# EAGLE board Hive 2.0 (EAGLE 9.6.2), part 1 of 2
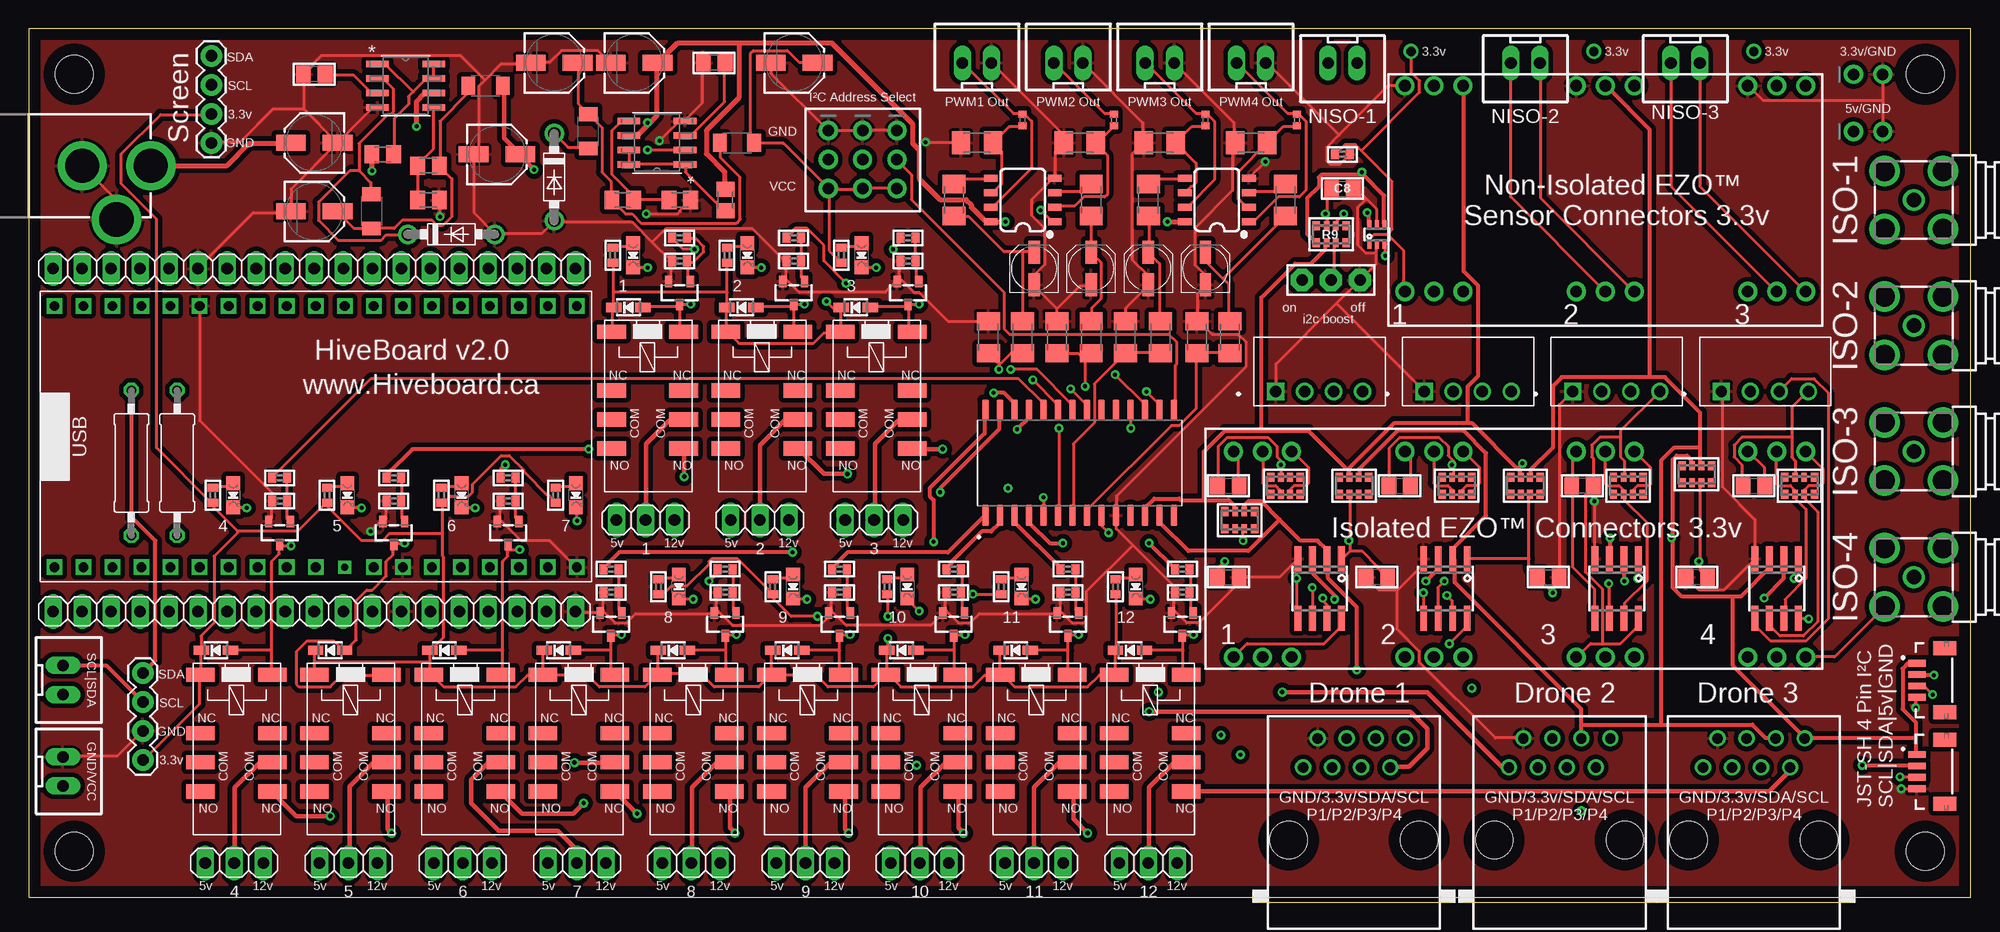
[diagram p7: board, top side]
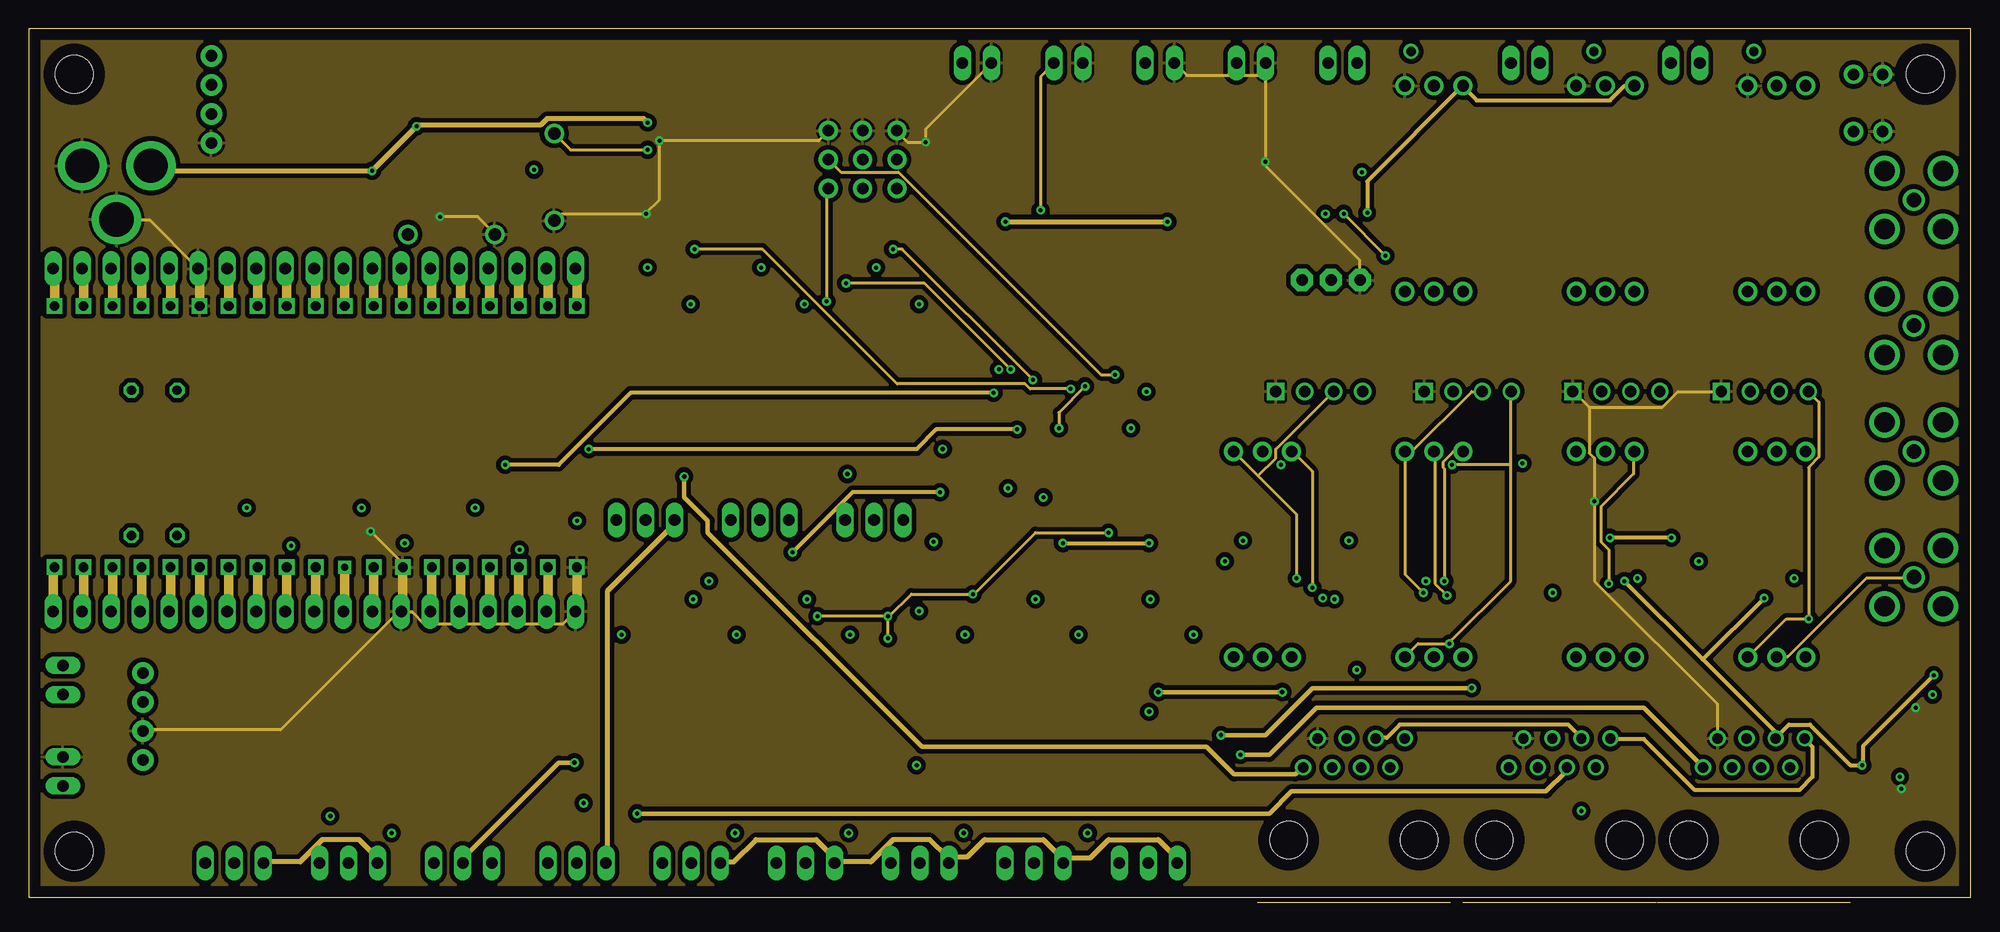
[diagram p8: board, inner layer Route2]
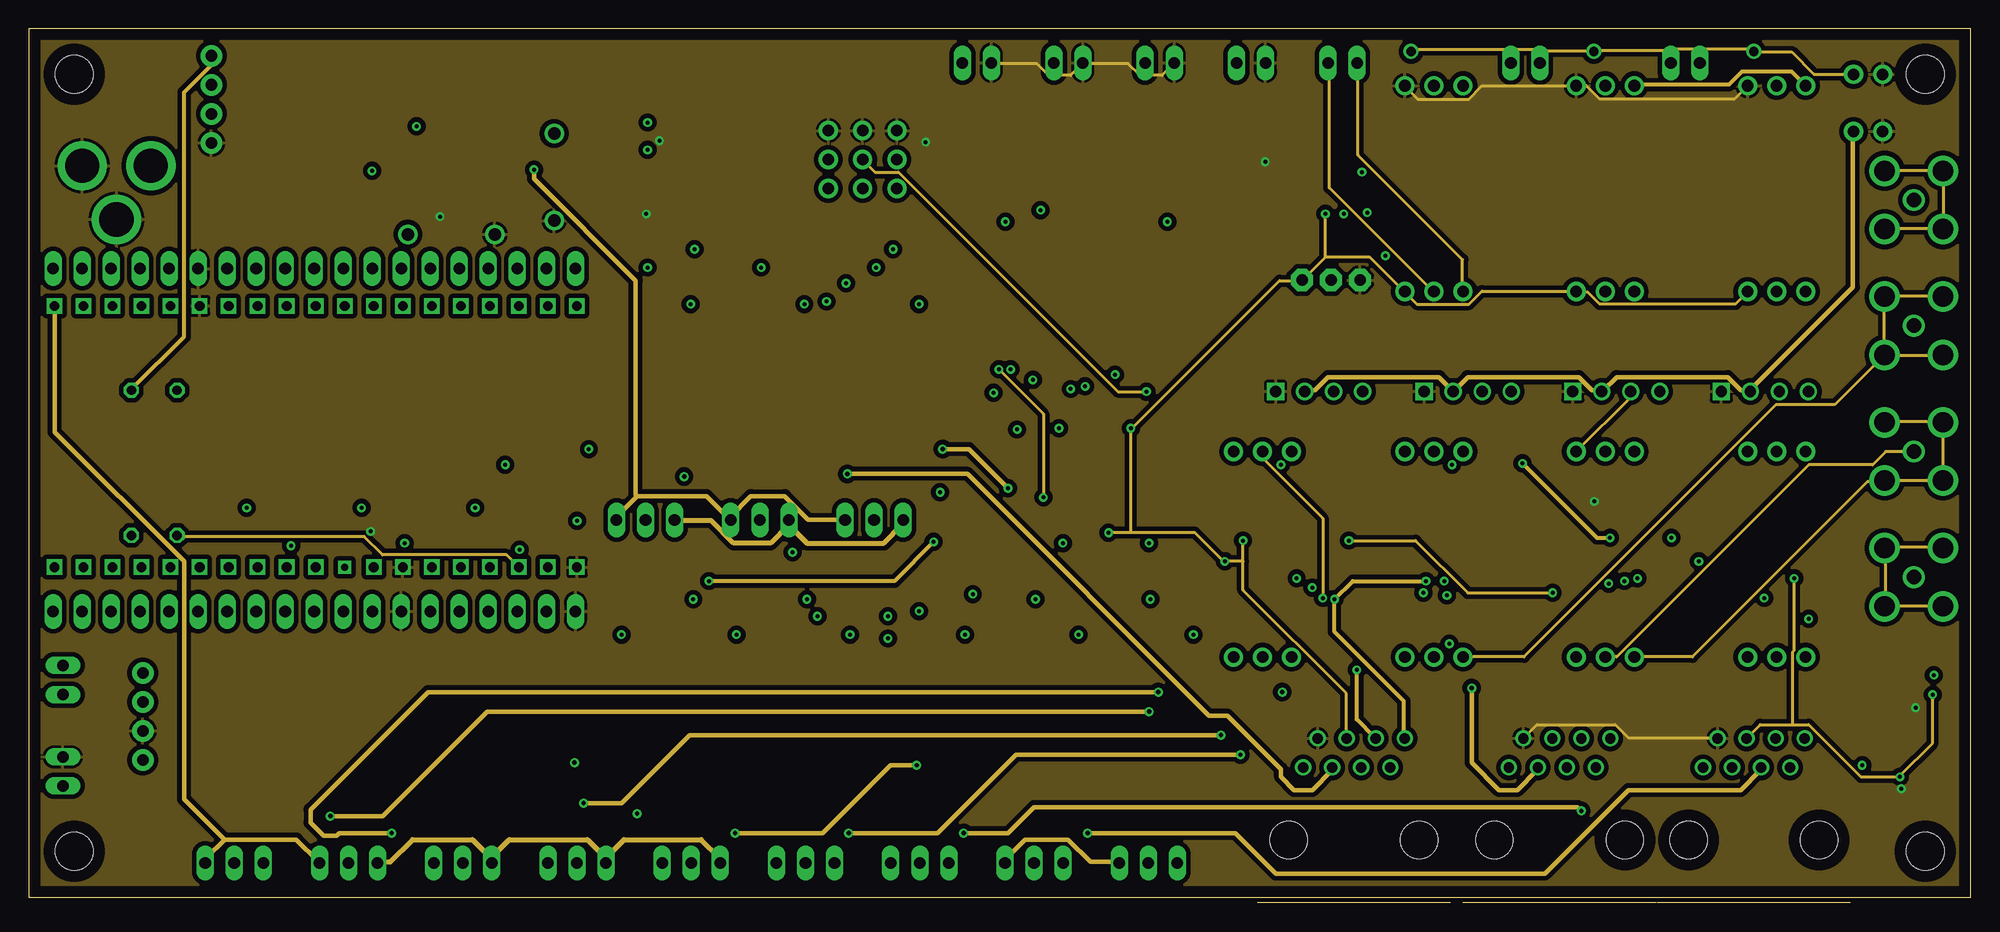
[diagram p9: board, inner layer Route15]
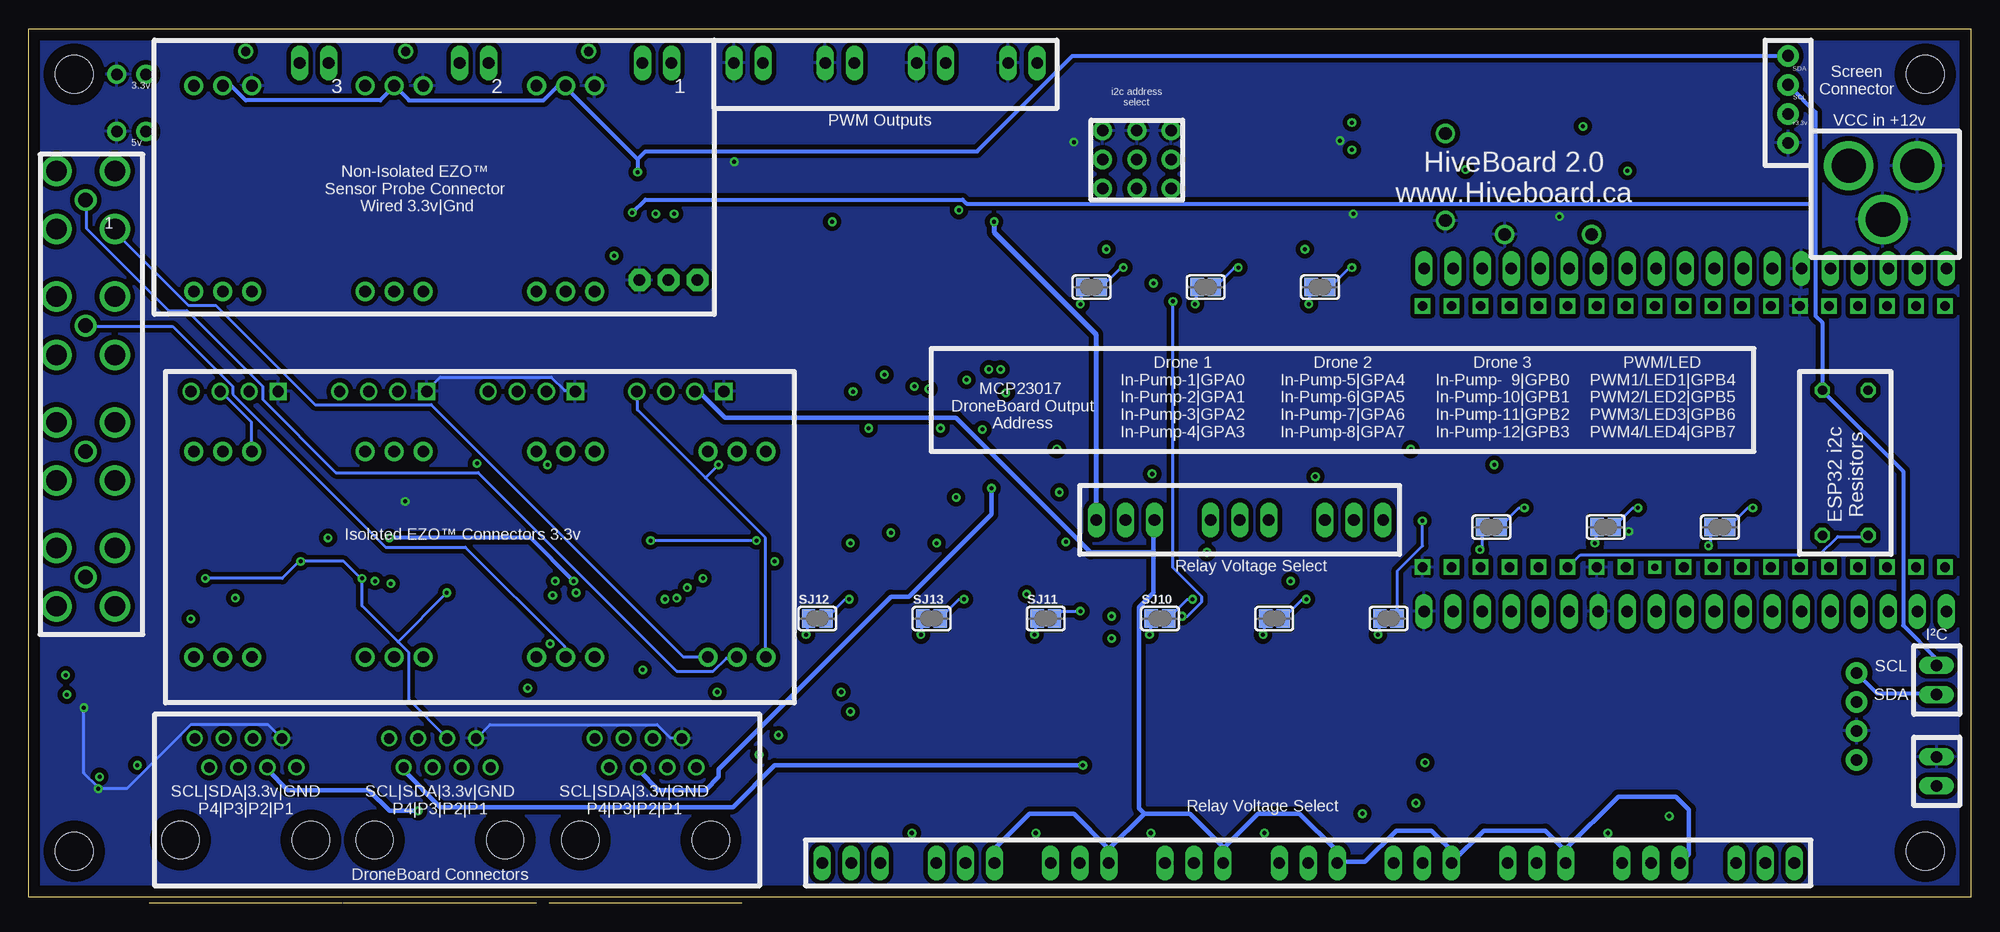
[diagram p10: board, bottom side, seen from below]

Size 170 x 76 mm. Coordinates in mm from the lower left corner, seen from the top.
Outline: 0,0 170,0 170,76 0,76 0,0
Copper layers (1+2*15+16): Top 0.035mm / dielectric 1.5mm / Route2 0.035mm / dielectric 0.15mm / Route15 0.035mm / dielectric 0.2mm / Bottom 0.035mm
Design rules "default *": minimum track width 6mil, minimum drill 0.35mm, track to track 6mil, track to pad 6mil, pad to pad 6mil, via to via 6mil, smd to smd 6mil, copper to edge 40mil, drill to drill 6mil, minimum pad ring 10mil, minimum via ring 8mil, stop-mask expansion 4mil, vias tented up to drill 0mil, thermal gap 10mil
Net classes: 0 default: width 0.254 mm, clearance 0.203 mm; 1 HV: width 0.406 mm, drill 0.381 mm, clearance 1.016 mm; 2 12v: width 0.457 mm, drill 0.102 mm, clearance 0.254 mm; 3 5v: width 0.406 mm, drill 0.102 mm, clearance 0.254 mm; 4 3.3v: width 0.406 mm, drill 0.102 mm, clearance 0.254 mm; 5 i2c: width 0.356 mm, drill 0.102 mm, clearance 0.254 mm; 6 GPIO: width 0.356 mm, drill 0.102 mm, clearance 0.254 mm; 8 New Class: drill 0.102 mm, clearance 0.152 mm

## Footprints (pad centres in the part's own frame; a part is rotated, then mirrored left to right if it is on the bottom)
PANASONIC_C = smd 2.6 x 1.4: + 2.05,0; - -2.05,0
UD-4X5,8_NICHICON = smd 2 x 1: + 1.425,0; - -1.425,0
0805 = smd 1.3 x 1.5: 1 -0.95,0; 2 0.95,0
0402 = smd 0.7 x 0.9: 1 -0.65,0; 2 0.65,0
DO41-7.6 = drill 1.1 pad 1.7: A 3.81,0; C -3.81,0
SOD-323 = smd 1.35 x 0.8: A 1.27,0; C -1.27,0
CHIPLED_0805_NOOUTLINE = smd 1.2 x 1.2: A 0,-1.05; C 0,1.05
STAND-OFF = hole 3.302: 0,0
SC70-6L = smd 0.35 x 0.8: 1 -0.65,-0.85; 2 0,-0.85; 3 0.65,-0.85; 4 0.65,0.85; 5 0,0.85; 6 -0.65,0.85
1X04 = drill 1.016 pad 1.88: 1 0,0; 2 2.54,0; 3 5.08,0; 4 7.62,0
JST04_1MM_VERT = smd 0.6 x 1.55: 1 -1.478,0.775; 2 -0.478,0.775; 3 0.522,0.775; 4 1.522,0.775 | smd 1.2 x 2: NC1 -2.778,3.2; NC2 2.822,3.2
POWER_JACK_PTH = drill 2.997 pad 4.318: GND 0,7.7; GNDBREAK 4.7,10.7; PWR 0,13.7
1X03_ROUND = drill 1 pad 1.676: 1 -2.54,0; 2 0,0; 3 2.54,0
1X01_2MM = drill 0.8 pad 1.27: 1 0,0
1X03-CLEANBIG = drill 1.016 pad 1.676: 1 -2.54,0; 2 0,0; 3 2.54,0
1X03 = drill 1.016 long: 1 -2.54,0; 2 0,0; 3 2.54,0
JUMPER3 = drill 1 pad 1.93 octagon: 1 -2.54,0; 2 0,0; 3 2.54,0
1X02_ROUND = drill 1 pad 1.676: 1 -1.27,0; 2 1.27,0
1X19 = drill 1.016 long: 1 -22.86,0; 2 -20.32,0; 3 -17.78,0; 4 -15.24,0; 5 -12.7,0; 6 -10.16,0; 7 -7.62,0; 8 -5.08,0; 9 -2.54,0; 10 0,0; 11 2.54,0; 12 5.08,0; 13 7.62,0; 14 10.16,0; 15 12.7,0; 16 15.24,0; 17 17.78,0; 18 20.32,0; 19 22.86,0
L3216C = smd 1.2 x 1.6: 1 -1.5,0; 2 1.5,0
CONV_RFM-0505S = drill 1 square: 1 -3.85,-1.75 | drill 1: 2 -1.31,-1.75; 3 1.23,-1.75; 4 3.77,-1.75
SOT23-R = smd 0.635 x 1.016: 1 -0.95,-1; 2 0.95,-1; 3 0,1
M0805 = smd 1.3 x 1.6: 1 -0.95,0; 2 0.95,0
M1206 = smd 1.6 x 2: 1 -1.4,0; 2 1.4,0
R0402 = smd 0.6 x 0.7: 1 -0.5,0; 2 0.5,0
0309/12 = drill 0.813 octagon: 1 -6.35,0; 2 6.35,0
RESPACK_4X0603 = smd 0.65 x 0.8: 1 -1.3,-0.75; 4 1.3,-0.75; 5 1.3,0.75; 8 -1.3,0.75 | smd 0.5 x 0.8: 2 -0.4,-0.75; 3 0.4,-0.75; 6 0.4,0.75; 7 -0.4,0.75
SOLDERJUMPER_CLOSEDWIRE = smd 1.168 x 1.6: 1 -0.762,0; 2 0.762,0 | smd 0.635 x 0.203: WIRE 0,0
SOIC127P1030X265-28N = smd 1.9 x 0.6: 1 -4.605,8.255; 2 -4.605,6.985; 3 -4.605,5.715; 4 -4.605,4.445; 5 -4.605,3.175; 6 -4.605,1.905; 7 -4.605,0.635; 8 -4.605,-0.635; 9 -4.605,-1.905; 10 -4.605,-3.175; 11 -4.605,-4.445; 12 -4.605,-5.715; 13 -4.605,-6.985; 14 -4.605,-8.255; 15 4.605,-8.255; 16 4.605,-6.985; 17 4.605,-5.715; 18 4.605,-4.445; 19 4.605,-3.175; 20 4.605,-1.905; 21 4.605,-0.635; 22 4.605,0.635; 23 4.605,1.905; 24 4.605,3.175; 25 4.605,4.445; 26 4.605,5.715; 27 4.605,6.985; 28 4.605,8.255
SO08 = smd 0.6 x 1.2: 1 -1.905,-2.8; 2 -0.635,-2.8; 3 0.635,-2.8; 4 1.905,-2.8; 5 1.905,2.8; 6 0.635,2.8; 7 -0.635,2.8; 8 -1.905,2.8
D8 = smd 1.981 x 0.559: 1 -2.464,1.905; 2 -2.464,0.635; 3 -2.464,-0.635; 4 -2.464,-1.905; 5 2.464,-1.905; 6 2.464,-0.635; 7 2.464,0.635; 8 2.464,1.905
ESP32 = drill 0.85 square: 3.3V 1.27,46.99; 5V 1.27,1.27; EN 1.27,44.45; GND1 1.27,13.97; GND2 24.13,46.99; GND3 24.13,31.75; GPIO0 24.13,13.97; GPIO2 24.13,11.43; GPIO4 24.13,16.51; GPIO5 24.13,24.13; GPIO6 24.13,1.27; GPIO7 24.13,3.81; GPIO8 24.13,6.35; GPIO9 1.27,8.89; GPIO10 1.27,6.35; GPIO11 1.27,3.81; GPIO12 1.27,16.51; GPIO13 1.27,11.43; GPIO14 1.27,19.05; GPIO15 24.13,8.89; GPIO16 24.13,19.05; GPIO17 24.13,21.59; GPIO19 24.13,29.21; GPIO21 24.13,34.29; GPIO22 24.13,41.91; GPIO23 24.13,44.45; GPIO25 1.27,26.67; GPIO26 1.27,24.13; GPIO27 1.27,21.59; GPIO32 1.27,31.75; GPIO33 1.27,29.21; GPIO34 1.27,36.83; GPIO35 1.27,34.29; GPIO36 1.27,41.91; GPIO39 1.27,39.37; RX 24.13,36.83; TX 24.13,39.37 | drill 0.6 square: GPIO18 24.13,26.67
JST-XH-02-PACKAGE-LONG-PAD = drill 1.016 long: 1 -1.27,0; 2 1.27,0
RELAY_EE2_NOLATCH = smd 1.25 x 2.5: 1 -6.5,-3.15; 3 -1.37,-3.15; 4 1.17,-3.15; 5 3.71,-3.15; 8 3.71,3.15; 9 1.17,3.15; 10 -1.37,3.15; 12 -6.5,3.15
SOIC8_150MIL = smd 0.6 x 2.2: 1 -1.905,-2.6; 2 -0.635,-2.6; 3 0.635,-2.6; 4 1.905,-2.6; 5 1.905,2.6; 6 0.635,2.6; 7 -0.635,2.6; 8 -1.905,2.6
RJ45-NO-SHIELD = drill 0.9 pad 1.4: 1 -4.445,6.35; 2 -3.175,8.89; 3 -1.905,6.35; 4 -0.635,8.89; 5 0.635,6.35; 6 1.905,8.89; 7 3.175,6.35; 8 4.445,8.89 | hole 3.251: -5.715,0; 5.715,0
BU-SMA-G = drill 1.27: 1 0,0 | drill 1.778: 2 -2.55,2.55; 3 2.55,2.55; 4 2.55,-2.55; 5 -2.55,-2.55

## Placement (x,y rotation side)
C1  470uF  [PANASONIC_C]  25,60 0 top
C1A1  1uf 50v  [UD-4X5,8_NICHICON]  88,55 90 top
C1A2  1uf 50v  [UD-4X5,8_NICHICON]  98,55 90 top
C1B1  1uf 50v  [UD-4X5,8_NICHICON]  93,55 90 top
C1B2  1uf 50v  [UD-4X5,8_NICHICON]  103,55 90 top
C2  100uF  [PANASONIC_C]  25,66 180 top
C3  100uF  [PANASONIC_C]  41,65 0 top
C4  470pF  [0805]  25,72 180 top
C5  470uF  [PANASONIC_C]  46,73 0 top
C6  100uF  [PANASONIC_C]  53,73 0 top
C7  10uF  [0402]  115,65 0 top
C8  0.1uF  [0805]  115,62 0 top
C9  100uF  [PANASONIC_C]  67,73 0 top
C10  0.1uF  [0805]  105,28 0 top
C11  0.1uF  [0805]  105,36 0 top
C12  0.1uF  [0805]  118,28 180 top
C13  0.1uF  [0805]  120,36 0 top
C14  0.1uF  [0805]  133,28 0 top
C15  0.1uF  [0805]  136,36 180 top
C16  0.1uF  [0805]  146,28 180 top
C17  0.1uF  [0805]  151,36 0 top
C18  470pF  [0805]  60,73 180 top
D1  1N5819-B  [DO41-7.6]  37,58 0 top
D2  1N5819-B  [DO41-7.6]  46,63 270 top
D4  1N4148  [SOD-323]  52.5,51.6 0 top
D5  RED  [CHIPLED_0805_NOOUTLINE]  52.91,56.17 180 top
D6  1N4148  [SOD-323]  62.4,51.6 0 top
D7  RED  [CHIPLED_0805_NOOUTLINE]  62.91,56.17 180 top
D8  1N4148  [SOD-323]  72.4,51.6 0 top
D9  RED  [CHIPLED_0805_NOOUTLINE]  72.91,56.17 180 top
D10  1N4148  [SOD-323]  16.4,21.6 0 top
D11  RED  [CHIPLED_0805_NOOUTLINE]  17.91,35.17 180 top
D12  1N4148  [SOD-323]  26.4,21.6 0 top
D13  RED  [CHIPLED_0805_NOOUTLINE]  27.91,35.17 180 top
D14  1N4148  [SOD-323]  36.4,21.6 0 top
D15  RED  [CHIPLED_0805_NOOUTLINE]  37.91,35.17 180 top
D16  1N4148  [SOD-323]  46.4,21.6 0 top
D17  RED  [CHIPLED_0805_NOOUTLINE]  47.91,35.17 180 top
D18  1N4148  [SOD-323]  56.4,21.6 0 top
D19  RED  [CHIPLED_0805_NOOUTLINE]  56.91,27.17 180 top
D20  1N4148  [SOD-323]  66.4,21.6 0 top
D21  RED  [CHIPLED_0805_NOOUTLINE]  66.91,27.17 180 top
D22  1N4148  [SOD-323]  76.4,21.6 0 top
D23  RED  [CHIPLED_0805_NOOUTLINE]  76.91,27.17 180 top
D24  1N4148  [SOD-323]  96.4,21.6 0 top
D25  RED  [CHIPLED_0805_NOOUTLINE]  96.91,27.17 180 top
D26  1N4148  [SOD-323]  86.4,21.6 0 top
D27  RED  [CHIPLED_0805_NOOUTLINE]  86.91,27.17 180 top
H1  STAND-OFF  [STAND-OFF]  4,72 0 top
H2  STAND-OFF  [STAND-OFF]  4,4 0 top
H3  STAND-OFF  [STAND-OFF]  166,4 0 top
H4  STAND-OFF  [STAND-OFF]  166,72 0 top
IC2  LTC4311_SC70  [SC70-6L]  118,58 0 top
J1  C2886705  [1X04]  10,12 90 top
J3  C2886705  [1X04]  16,66 90 top
J6  Vertical Qwiic Connector  [JST04_1MM_VERT]  164.5,19 270 top
J7  Vertical Qwiic Connector  [JST04_1MM_VERT]  164.5,11 270 top
J8  POWER_JACK  [POWER_JACK_PTH]  -3,64 270 top
JP1  [1X03_ROUND]  76,64.54 270 top
JP2  [1X03_ROUND]  73,64.54 270 top
JP3  [1X03_ROUND]  70,64.54 270 top
JP4  [1X01_2MM]  151,74 0 top
JP5  C2886705  [1X03-CLEANBIG]  123,71 180 top
JP6  C2886705  [1X03-CLEANBIG]  123,53 0 top
JP7  C2886705  [1X03-CLEANBIG]  138,71 180 top
JP8  C2886705  [1X03-CLEANBIG]  138,53 0 top
JP9  C2886705  [1X03-CLEANBIG]  153,71 180 top
JP10  C2886705  [1X03-CLEANBIG]  153,53 0 top
JP11  [1X03]  54,33 180 top
JP12  C2886705  [1X03-CLEANBIG]  108,39 180 top
JP13  C2886705  [1X03-CLEANBIG]  108,21 0 top
JP14  C2886705  [1X03-CLEANBIG]  123,39 180 top
JP15  C2886705  [1X03-CLEANBIG]  123,21 0 top
JP16  C2886705  [1X03-CLEANBIG]  138,39 180 top
JP17  C2886705  [1X03-CLEANBIG]  138,21 0 top
JP18  C2886705  [1X03-CLEANBIG]  153,39 180 top
JP19  C2886705  [1X03-CLEANBIG]  153,21 0 top
JP20  [1X03]  64,33 180 top
JP21  [1X03]  74,33 180 top
JP22  [1X03]  18,3 180 top
JP23  [1X03]  28,3 180 top
JP24  [1X03]  48,3 180 top
JP25  [1X03]  38,3 180 top
JP26  [1X03]  58,3 180 top
JP27  [1X03]  68,3 180 top
JP28  [1X03]  78,3 180 top
JP29  [1X03]  88,3 180 top
JP30  [1X03]  98,3 180 top
JP31  [JUMPER3]  114,54 180 top
JP32  [1X01_2MM]  137,74 0 top
JP33  [1X01_2MM]  121,74 0 top
JP34  [1X02_ROUND]  161,72 0 top
JP35  [1X02_ROUND]  161,67 0 top
JP38  [1X19]  25,55 180 top
JP39  [1X19]  25,25 180 top
L1  220uH  [L3216C]  30,60 270 top
L2  1uH  [L3216C]  40,71 0 top
L3  220uH  [L3216C]  49,67 90 top
L4  1uH  [L3216C]  62,66 0 top
PS1  RFM-0505S  [CONV_RFM-0505S]  113,46 0 top
PS2  RFM-0505S  [CONV_RFM-0505S]  126,46 0 top
PS3  RFM-0505S  [CONV_RFM-0505S]  139,46 0 top
PS4  RFM-0505S  [CONV_RFM-0505S]  152,46 0 top
Q3  MMBT2222  [SOT23-R]  56.97,52.87 180 top
Q5  MMBT2222  [SOT23-R]  66.97,52.87 180 top
Q6  MMBT2222  [SOT23-R]  76.97,52.87 180 top
Q7  MMBT2222  [SOT23-R]  21.97,31.87 180 top
Q8  MMBT2222  [SOT23-R]  31.97,31.87 180 top
Q9  MMBT2222  [SOT23-R]  41.97,31.87 180 top
Q10  MMBT2222  [SOT23-R]  50.97,23.87 180 top
Q11  MMBT2222  [SOT23-R]  60.97,23.87 180 top
Q12  MMBT2222  [SOT23-R]  70.97,23.87 180 top
Q13  MMBT2222  [SOT23-R]  80.97,23.87 180 top
Q14  MMBT2222  [SOT23-R]  100.97,23.87 180 top
Q15  MMBT2222  [SOT23-R]  90.97,23.87 180 top
R1  1K  [M0805]  35,61 180 top
R1A1  100kΩ  [M1206]  87,49 270 top
R1A2  100kΩ  [M1206]  99.07,49 270 top
R1B1  100kΩ  [M1206]  93,49 90 top
R1B2  100kΩ  [M1206]  105.14,49 90 top
R2  3K  [M0805]  35,64 180 top
R2A1  100kΩ  [M1206]  83,66 0 top
R2A2  100kΩ  [M1206]  99,66 0 top
R2B1  100kΩ  [M1206]  92,66 180 top
R2B2  100kΩ  [M1206]  107,66 180 top
R3  0.33R  [M0805]  31,65 0 top
R4  200KΩ  [R0402]  87,68 90 top
R4A1  75kΩ  [M1206]  98,61 90 top
R4A2  75kΩ  [M1206]  81,61 90 top
R4B1  75kΩ  [M1206]  93,61 90 top
R4B2  75kΩ  [M1206]  110,61 90 top
R5  200KΩ  [R0402]  95,68 90 top
R5A1  10kΩ  [M1206]  84,49 90 top
R5A2  10kΩ  [M1206]  96,49 90 top
R5B1  10kΩ  [M1206]  90,49 90 top
R5B2  10kΩ  [M1206]  102.27,49 90 top
R6  2.4k  [0309/12]  9,38 90 top
R7  2.4k  [0309/12]  13,38 90 top
R8  2.2K  [M0805]  52,61 0 top
R9  10K  [RESPACK_4X0603]  114,58 0 top
R10  200KΩ  [R0402]  103,68 90 top
R11  200KΩ  [R0402]  111,68 90 top
R12  100KΩ  [RESPACK_4X0603]  106,33 180 top
R13  10KΩ  [RESPACK_4X0603]  116,36 180 top
R14  100KΩ  [RESPACK_4X0603]  110,36 0 top
R15  1.2K  [M0805]  57,61 180 top
R16  10KΩ  [RESPACK_4X0603]  125,36 0 top
R17  10KΩ  [RESPACK_4X0603]  131,36 180 top
R18  10KΩ  [RESPACK_4X0603]  140,36 0 top
R19  0.33R  [M0805]  61,61 270 top
R20  10KΩ  [RESPACK_4X0603]  146,37 180 top
R21  10KΩ  [RESPACK_4X0603]  155,36 0 top
R26  1K  [0402]  56.97,57.7 0 top
R27  10K  [0402]  56.97,55.66 0 top
R28  1K  [0402]  51.13,56.17 270 top
R29  1K  [0402]  66.97,57.7 0 top
R30  10K  [0402]  66.97,55.66 0 top
R31  1K  [0402]  61.13,56.17 270 top
R32  1K  [0402]  76.97,57.7 0 top
R33  10K  [0402]  76.97,55.66 0 top
R34  1K  [0402]  71.13,56.17 270 top
R35  1K  [0402]  21.97,36.7 0 top
R36  10K  [0402]  21.97,34.66 0 top
R37  1K  [0402]  16.13,35.17 270 top
R38  1K  [0402]  31.97,36.7 0 top
R39  10K  [0402]  31.97,34.66 0 top
R40  1K  [0402]  26.13,35.17 270 top
R41  1K  [0402]  41.97,36.7 0 top
R42  10K  [0402]  41.97,34.66 0 top
R43  1K  [0402]  36.13,35.17 270 top
R44  1K  [0402]  50.97,28.7 0 top
R45  10K  [0402]  50.97,26.66 0 top
R46  1K  [0402]  46.13,35.17 270 top
R47  1K  [0402]  60.97,28.7 0 top
R48  10K  [0402]  60.97,26.66 0 top
R49  1K  [0402]  55.13,27.17 270 top
R50  1K  [0402]  70.97,28.7 0 top
R51  10K  [0402]  70.97,26.66 0 top
R52  1K  [0402]  65.13,27.17 270 top
R53  1K  [0402]  80.97,28.7 0 top
R54  10K  [0402]  80.97,26.66 0 top
R55  1K  [0402]  75.13,27.17 270 top
R56  1K  [0402]  100.97,28.7 0 top
R57  10K  [0402]  100.97,26.66 0 top
R58  1K  [0402]  95.13,27.17 270 top
R59  1K  [0402]  90.97,28.7 0 top
R60  10K  [0402]  90.97,26.66 0 top
R61  1K  [0402]  85.13,27.17 270 top
SJ2  [SOLDERJUMPER_CLOSEDWIRE]  56.97,53.38 0 bottom
SJ3  [SOLDERJUMPER_CLOSEDWIRE]  66.97,53.38 0 bottom
SJ4  [SOLDERJUMPER_CLOSEDWIRE]  76.97,53.38 0 bottom
SJ5  [SOLDERJUMPER_CLOSEDWIRE]  21.97,32.38 0 bottom
SJ6  [SOLDERJUMPER_CLOSEDWIRE]  31.97,32.38 0 bottom
SJ7  [SOLDERJUMPER_CLOSEDWIRE]  41.97,32.38 0 bottom
SJ8  [SOLDERJUMPER_CLOSEDWIRE]  50.97,24.38 0 bottom
SJ9  [SOLDERJUMPER_CLOSEDWIRE]  60.97,24.38 0 bottom
SJ10  [SOLDERJUMPER_CLOSEDWIRE]  70.97,24.38 0 bottom
SJ11  [SOLDERJUMPER_CLOSEDWIRE]  80.97,24.38 0 bottom
SJ12  [SOLDERJUMPER_CLOSEDWIRE]  100.97,24.38 0 bottom
SJ13  [SOLDERJUMPER_CLOSEDWIRE]  90.97,24.38 0 bottom
U1  MCP23017-E/SO  [SOIC127P1030X265-28N]  92,38 90 top
U2  LM358  [SO08]  87,61 90 top
U3  LM358  [SO08]  104,61 90 top
U4  MC34063ADR  [D8]  33,71 0 top
U5  MC34063ADR  [D8]  55,66 180 top
U$2  ESP32  [ESP32]  1,53 270 top
X1  PWM2  [JST-XH-02-PACKAGE-LONG-PAD]  91,73 0 top
X2  PWM1  [JST-XH-02-PACKAGE-LONG-PAD]  83,73 0 top
X3  jst-xh-2  [JST-XH-02-PACKAGE-LONG-PAD]  3,19 270 top
X5  RELAY_NONLATCHING-EE2NUH  [RELAY_EE2_NOLATCH]  54.18,42.96 270 top
X6  PWM3  [JST-XH-02-PACKAGE-LONG-PAD]  99,73 0 top
X7  PWM4  [JST-XH-02-PACKAGE-LONG-PAD]  107,73 0 top
X8  ISO154X  [SOIC8_150MIL]  113,27 180 top
X9  RJ45-6L-B  [RJ45-NO-SHIELD]  116,5 0 top
X10  ISO154X  [SOIC8_150MIL]  124,27 180 top
X11  jst-xh-2  [JST-XH-02-PACKAGE-LONG-PAD]  115,73 180 top
X12  ISO154X  [SOIC8_150MIL]  139,27 180 top
X13  RJ45-6L-B  [RJ45-NO-SHIELD]  134,5 0 top
X14  jst-xh-2  [JST-XH-02-PACKAGE-LONG-PAD]  131,73 180 top
X15  ISO154X  [SOIC8_150MIL]  153,27 180 top
X16  RJ45-6L-B  [RJ45-NO-SHIELD]  151,5 0 top
X17  jst-xh-2  [JST-XH-02-PACKAGE-LONG-PAD]  145,73 180 top
X18  BU-SMA-G  [BU-SMA-G]  165,61 0 top
X19  BU-SMA-G  [BU-SMA-G]  165,50 0 top
X20  BU-SMA-G  [BU-SMA-G]  165,39 0 top
X21  BU-SMA-G  [BU-SMA-G]  165,28 0 top
X22  jst-xh-2  [JST-XH-02-PACKAGE-LONG-PAD]  3,11 270 top
X23  RELAY_NONLATCHING-EE2NUH  [RELAY_EE2_NOLATCH]  64.18,42.96 270 top
X24  RELAY_NONLATCHING-EE2NUH  [RELAY_EE2_NOLATCH]  74.18,42.96 270 top
X25  RELAY_NONLATCHING-EE2NUH  [RELAY_EE2_NOLATCH]  18.18,12.96 270 top
X26  RELAY_NONLATCHING-EE2NUH  [RELAY_EE2_NOLATCH]  28.18,12.96 270 top
X27  RELAY_NONLATCHING-EE2NUH  [RELAY_EE2_NOLATCH]  38.18,12.96 270 top
X28  RELAY_NONLATCHING-EE2NUH  [RELAY_EE2_NOLATCH]  48.18,12.96 270 top
X29  RELAY_NONLATCHING-EE2NUH  [RELAY_EE2_NOLATCH]  58.18,12.96 270 top
X30  RELAY_NONLATCHING-EE2NUH  [RELAY_EE2_NOLATCH]  68.18,12.96 270 top
X31  RELAY_NONLATCHING-EE2NUH  [RELAY_EE2_NOLATCH]  78.18,12.96 270 top
X32  RELAY_NONLATCHING-EE2NUH  [RELAY_EE2_NOLATCH]  98.18,12.96 270 top
X33  RELAY_NONLATCHING-EE2NUH  [RELAY_EE2_NOLATCH]  88.18,12.96 270 top